# Altium schematic sheet dmpro16-pcb-v1-MCU.SchDoc
size A4; DocumentNumber: 11; SheetNumber: 11; SheetTotal: 17; SheetName: MCU
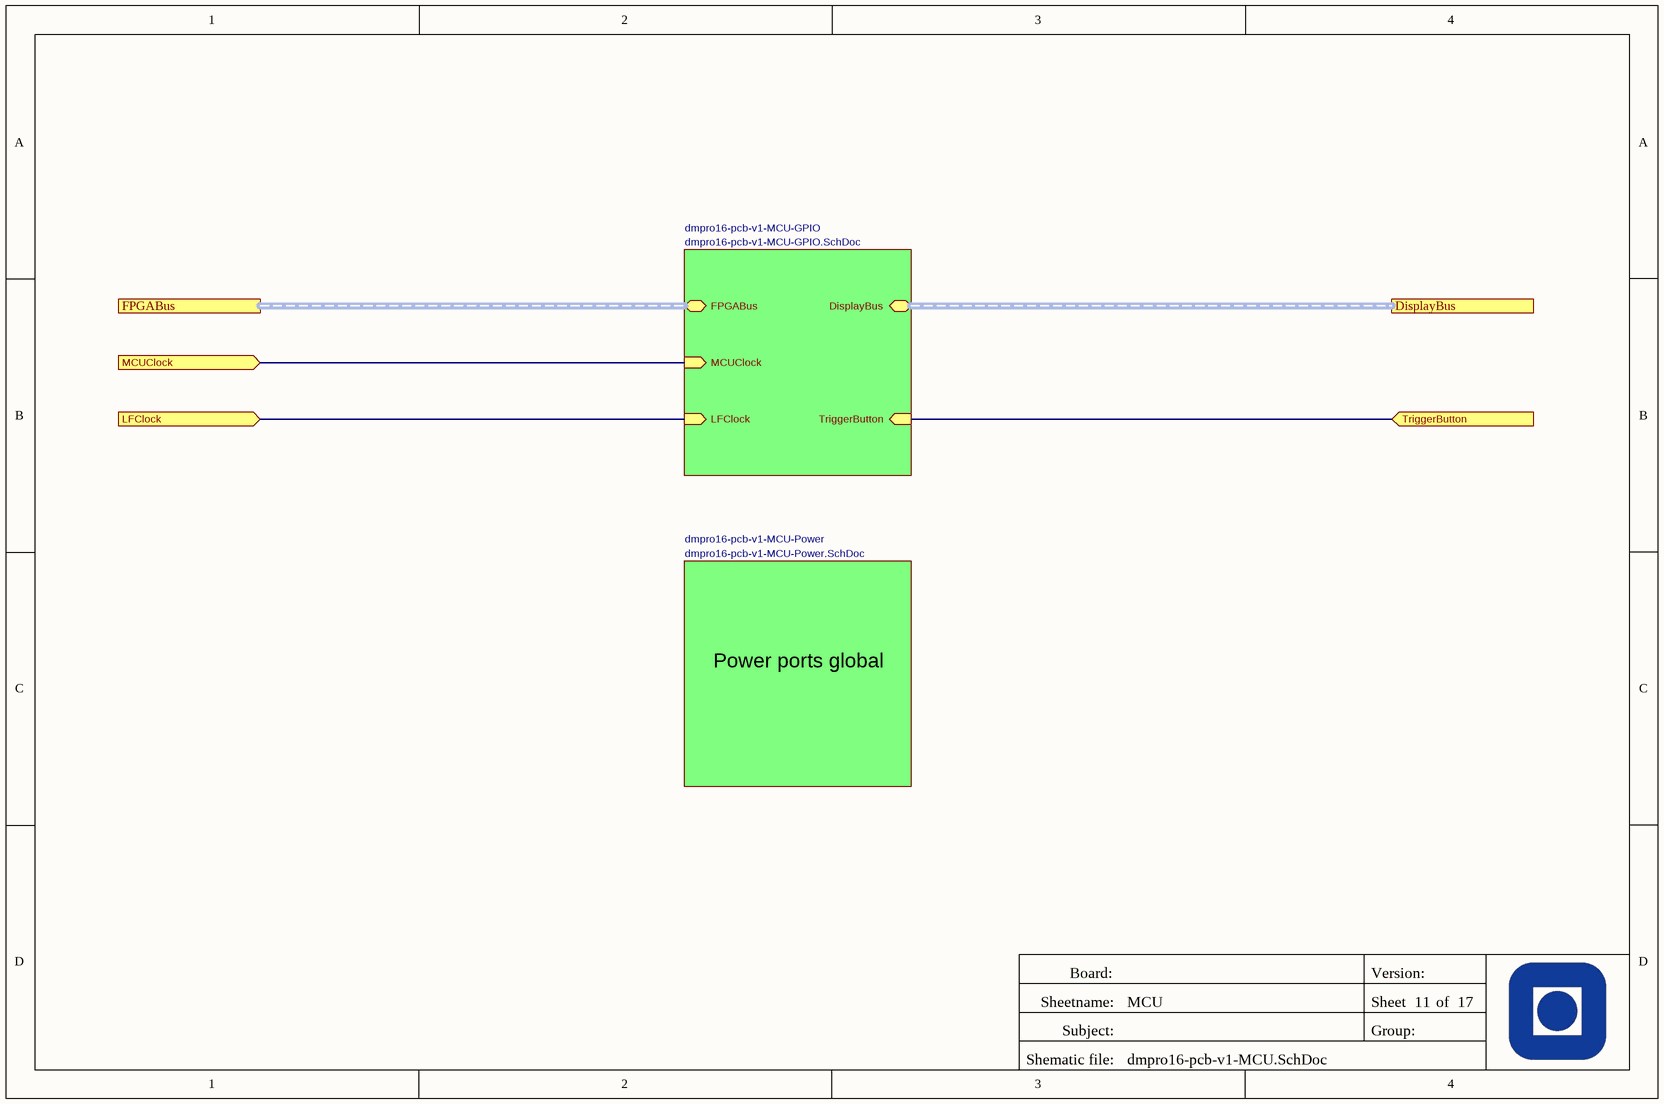
[diagram p0: dmpro16-pcb-v1-MCU.SchDoc]

## Sub-sheets
dmpro16-pcb-v1-MCU-GPIO = dmpro16-pcb-v1-MCU-GPIO.SchDoc: FPGABus (harness FPGABus), DisplayBus (harness DisplayBus), TriggerButton (in), MCUClock (in), LFClock (in)
dmpro16-pcb-v1-MCU-Power = dmpro16-pcb-v1-MCU-Power.SchDoc: no entries

## Ports
DisplayBus (harness DisplayBus), FPGABus (harness FPGABus), LFClock (in), MCUClock (in), TriggerButton (in)

## Nets
LFClock: port LFClock, sheet dmpro16-pcb-v1-MCU-GPIO/LFClock
MCUClock: port MCUClock, sheet dmpro16-pcb-v1-MCU-GPIO/MCUClock
TriggerButton: port TriggerButton, sheet dmpro16-pcb-v1-MCU-GPIO/TriggerButton

## Buses and harness runs
harness port DisplayBus = sheet dmpro16-pcb-v1-MCU-GPIO/DisplayBus
harness port FPGABus = sheet dmpro16-pcb-v1-MCU-GPIO/FPGABus

## Notes on the sheet
- Power ports global
- Board:
- Version:
- Sheetname:
- Subject:
- Group:
- Sheet
- of
- Shematic file: